# EAGLE design control_board (EAGLE 6.4)
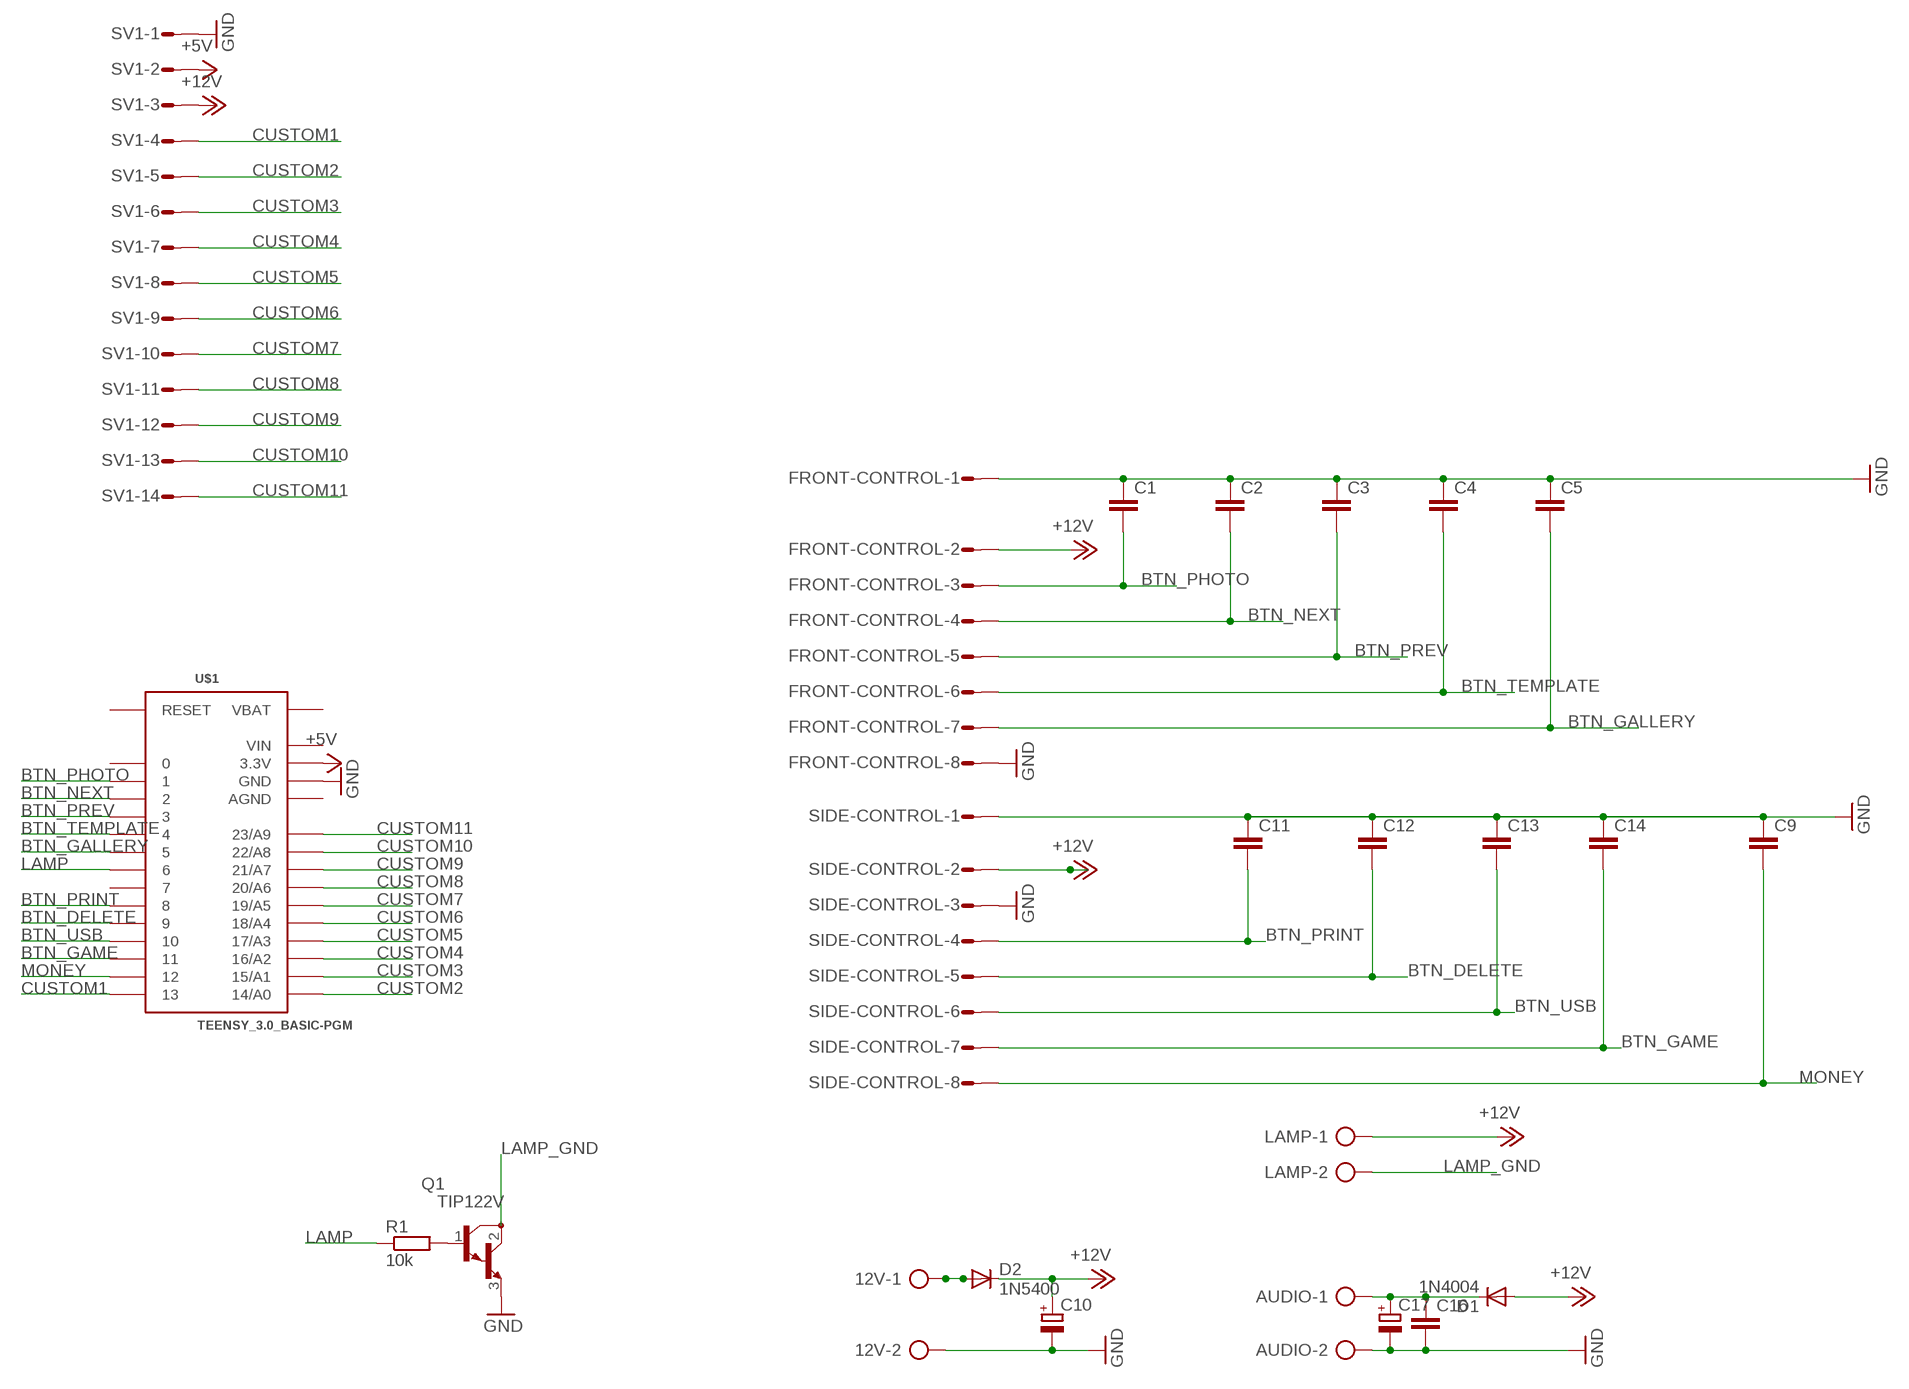
[diagram p0: schematic, sheet 1]

## Parts
12V  AK300/2  [AK300/2]
AUDIO  AK300/2  [AK300/2]
C1  C-EU025-025X050  [C025-025X050]
C2  C-EU025-025X050  [C025-025X050]
C3  C-EU025-025X050  [C025-025X050]
C4  C-EU025-025X050  [C025-025X050]
C5  C-EU025-025X050  [C025-025X050]
C9  C-EU025-025X050  [C025-025X050]
C10  CPOL-EUE5-8.5  [E5-8,5]
C11  C-EU025-025X050  [C025-025X050]
C12  C-EU025-025X050  [C025-025X050]
C13  C-EU025-025X050  [C025-025X050]
C14  C-EU025-025X050  [C025-025X050]
C16  C-EU025-025X050  [C025-025X050]
C17  CPOL-EUE5-5  [E5-5]
D1  1N4004  [DO41-10]
D2  1N5400  [DO201-15]
FRONT-CONTROL  S08P  [S08P]
LAMP  AK300/2  [AK300/2]
Q1  TIP122V  [TO220V]
R1  10k  R-EU_0204/7  [0204/7]
SIDE-CONTROL  S08P  [S08P]
SV1  S14P  [S14P]
U$1  TEENSY_3.0_BASIC-PGM  [TEENSY_3.0_BASIC-PGM]

## Nets
+5V: SV1.2 U$1.3.3V U$1.3.3V1(3.3V)
+12V: C10.+ D1.A D2.C FRONT-CONTROL.2 LAMP.1 SIDE-CONTROL.2 SV1.3
BTN_DELETE: C12.2 SIDE-CONTROL.5 U$1.9
BTN_GALLERY: C5.2 FRONT-CONTROL.7 U$1.5
BTN_GAME: C14.2 SIDE-CONTROL.7 U$1.11
BTN_NEXT: C2.2 FRONT-CONTROL.4 U$1.2
BTN_PHOTO: C1.2 FRONT-CONTROL.3 U$1.1
BTN_PREV: C3.2 FRONT-CONTROL.5 U$1.3
BTN_PRINT: C11.2 SIDE-CONTROL.4 U$1.8
BTN_TEMPLATE: C4.2 FRONT-CONTROL.6 U$1.4
BTN_USB: C13.2 SIDE-CONTROL.6 U$1.10
CUSTOM1: SV1.4 U$1.13
CUSTOM2: SV1.5 U$1.14/A0
CUSTOM3: SV1.6 U$1.15/A1
CUSTOM4: SV1.7 U$1.16/A2
CUSTOM5: SV1.8 U$1.17/A3
CUSTOM6: SV1.9 U$1.18/A4
CUSTOM7: SV1.10 U$1.19/A5
CUSTOM8: SV1.11 U$1.20/A6
CUSTOM9: SV1.12 U$1.21/A7
CUSTOM10: SV1.13 U$1.22/A8
CUSTOM11: SV1.14 U$1.23/A9
GND: 12V.2 AUDIO.2 C1.1 C2.1 C3.1 C4.1 C5.1 C9.1 C10.- C11.1 C12.1 C13.1 C14.1 C16.2 C17.- FRONT-CONTROL.1 FRONT-CONTROL.8 Q1.3(E) SIDE-CONTROL.1 SIDE-CONTROL.3 SV1.1 U$1.GND U$1.GND1(GND)
LAMP: R1.1 U$1.6
LAMP_GND: LAMP.2 Q1.2(C)
MONEY: C9.2 SIDE-CONTROL.8 U$1.12
N$1: Q1.1(B) R1.2
N$2: AUDIO.1 C16.1 C17.+ D1.C
N$3: 12V.1 D2.A
Unconnected: U$1.0 U$1.7 U$1.RESET

## Power pins joined to a net without a drawn wire
AGND: U$1.AGND
VBAT: U$1.VBAT
VIN: U$1.VIN

## Library data of the parts
12V AUDIO LAMP = con-ptr500:AK300/2: CONNECTOR; OC_FARNELL: unknown; OC_NEWARK: unknown
C1-C5 = resistor:C-EU: CAPACITOR, European symbol
C9 C11-C14 C16 = rcl:C-EU: CAPACITOR, European symbol
C10 C17 = resistor:CPOL-EU: POLARIZED CAPACITOR, European symbol
D1 = diode:1N4004: DIODE general purpose rectifier, 1 A
D2 = diode:1N5400: DIODE standard rectifier, 3 A, 50 V (Motorola)
FRONT-CONTROL SIDE-CONTROL = con-amp-mt:S08P: AMP MT CONNECTOR; OC_FARNELL: unknown; OC_NEWARK: unknown
Q1 = transistor-npn:TIP122V
R1 = resistor:R-EU_: RESISTOR, European symbol
SV1 = con-amp-mt:S14P: AMP MT CONNECTOR; OC_FARNELL: unknown; OC_NEWARK: unknown
U$1 = Teensy3.0:TEENSY_3.0_BASIC-PGM: Teensy 3.0 Board outline identical to other 'basic' version except that 'PGM' pin has been omitted. See '+4', 'AllAnalogPins", and 'AllPins' packages for additional pin holes, as needed.

## Board
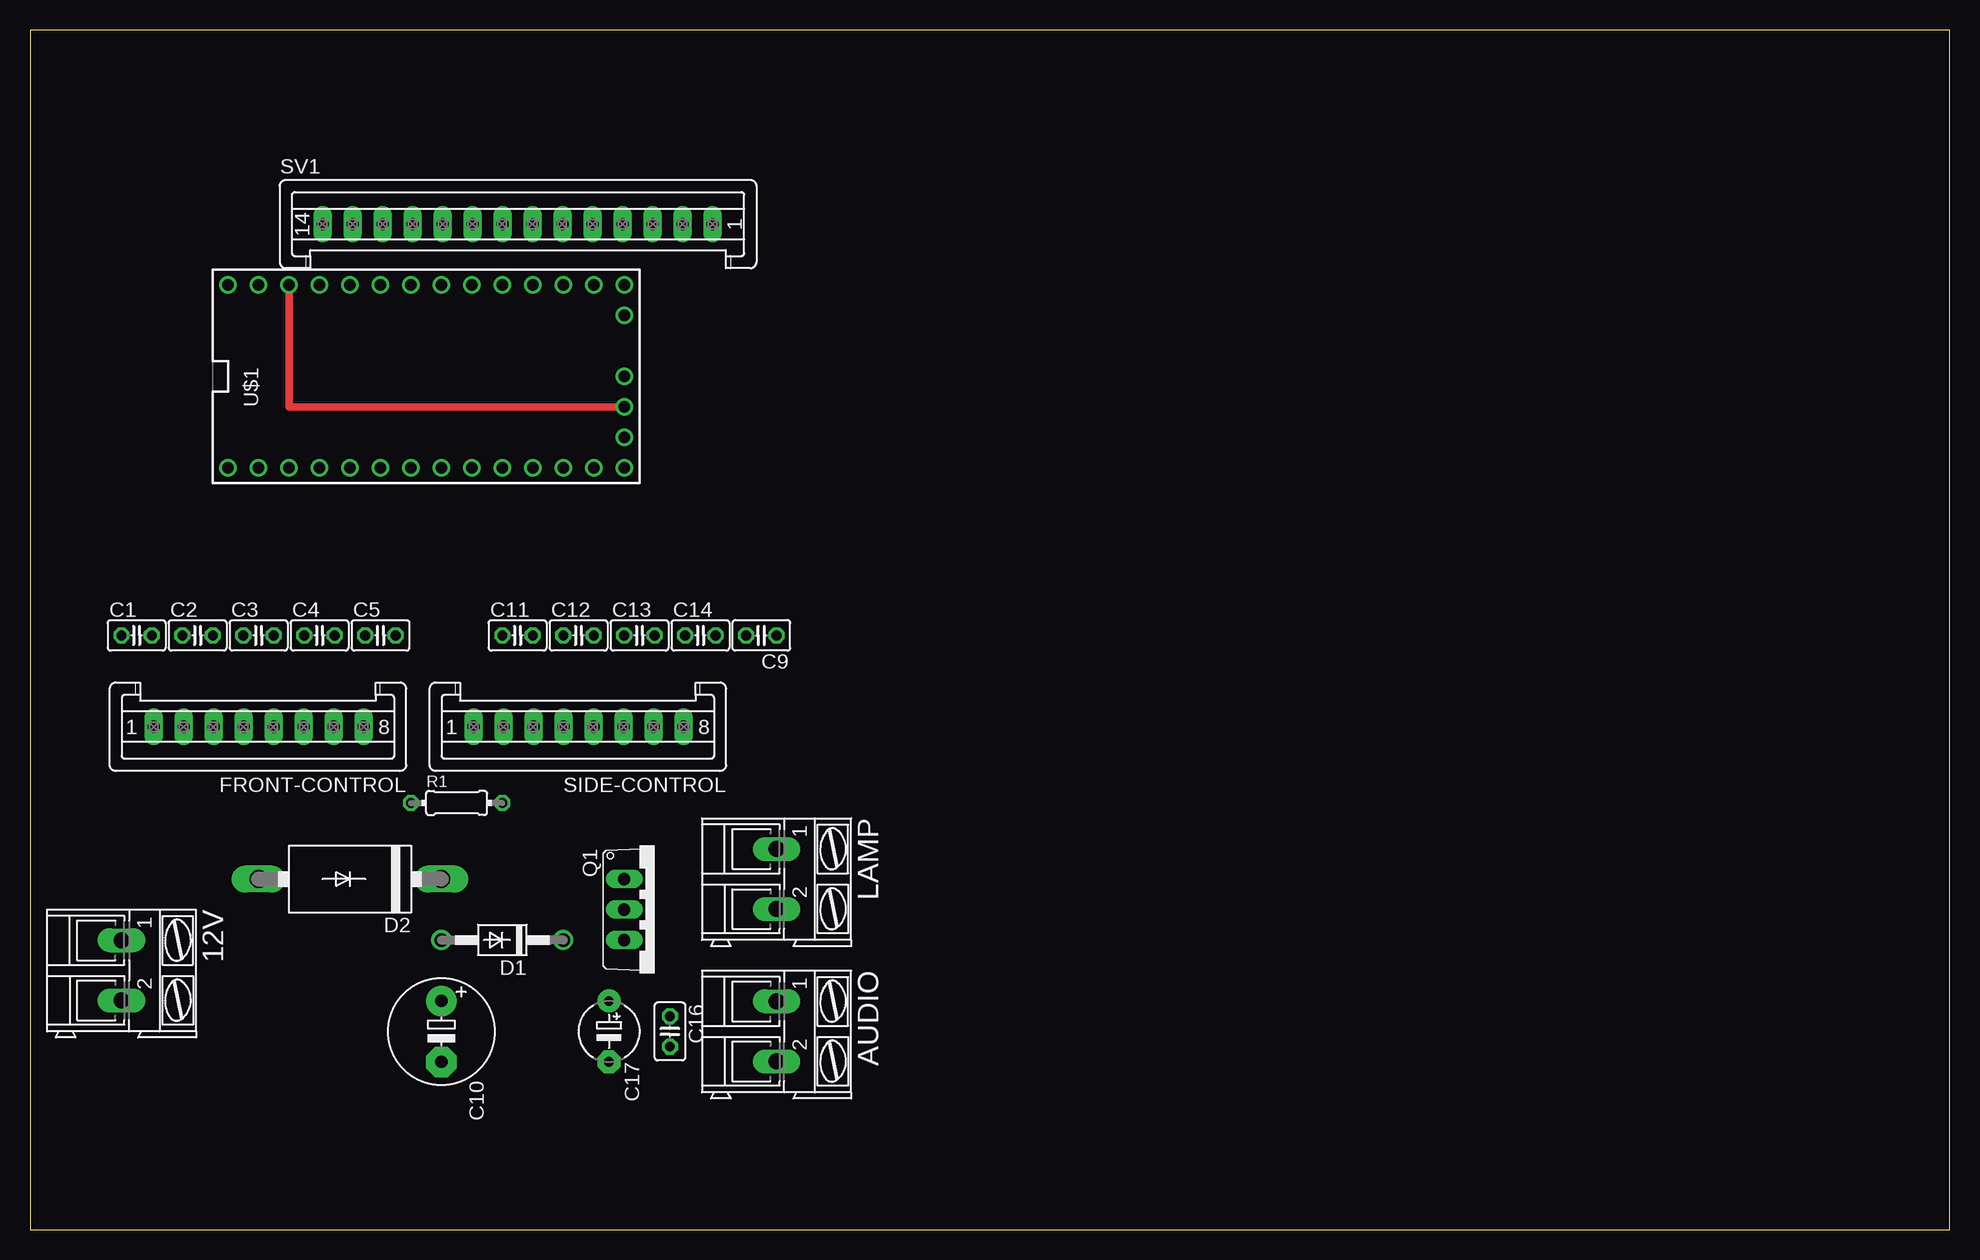
[diagram p1: board, top side]
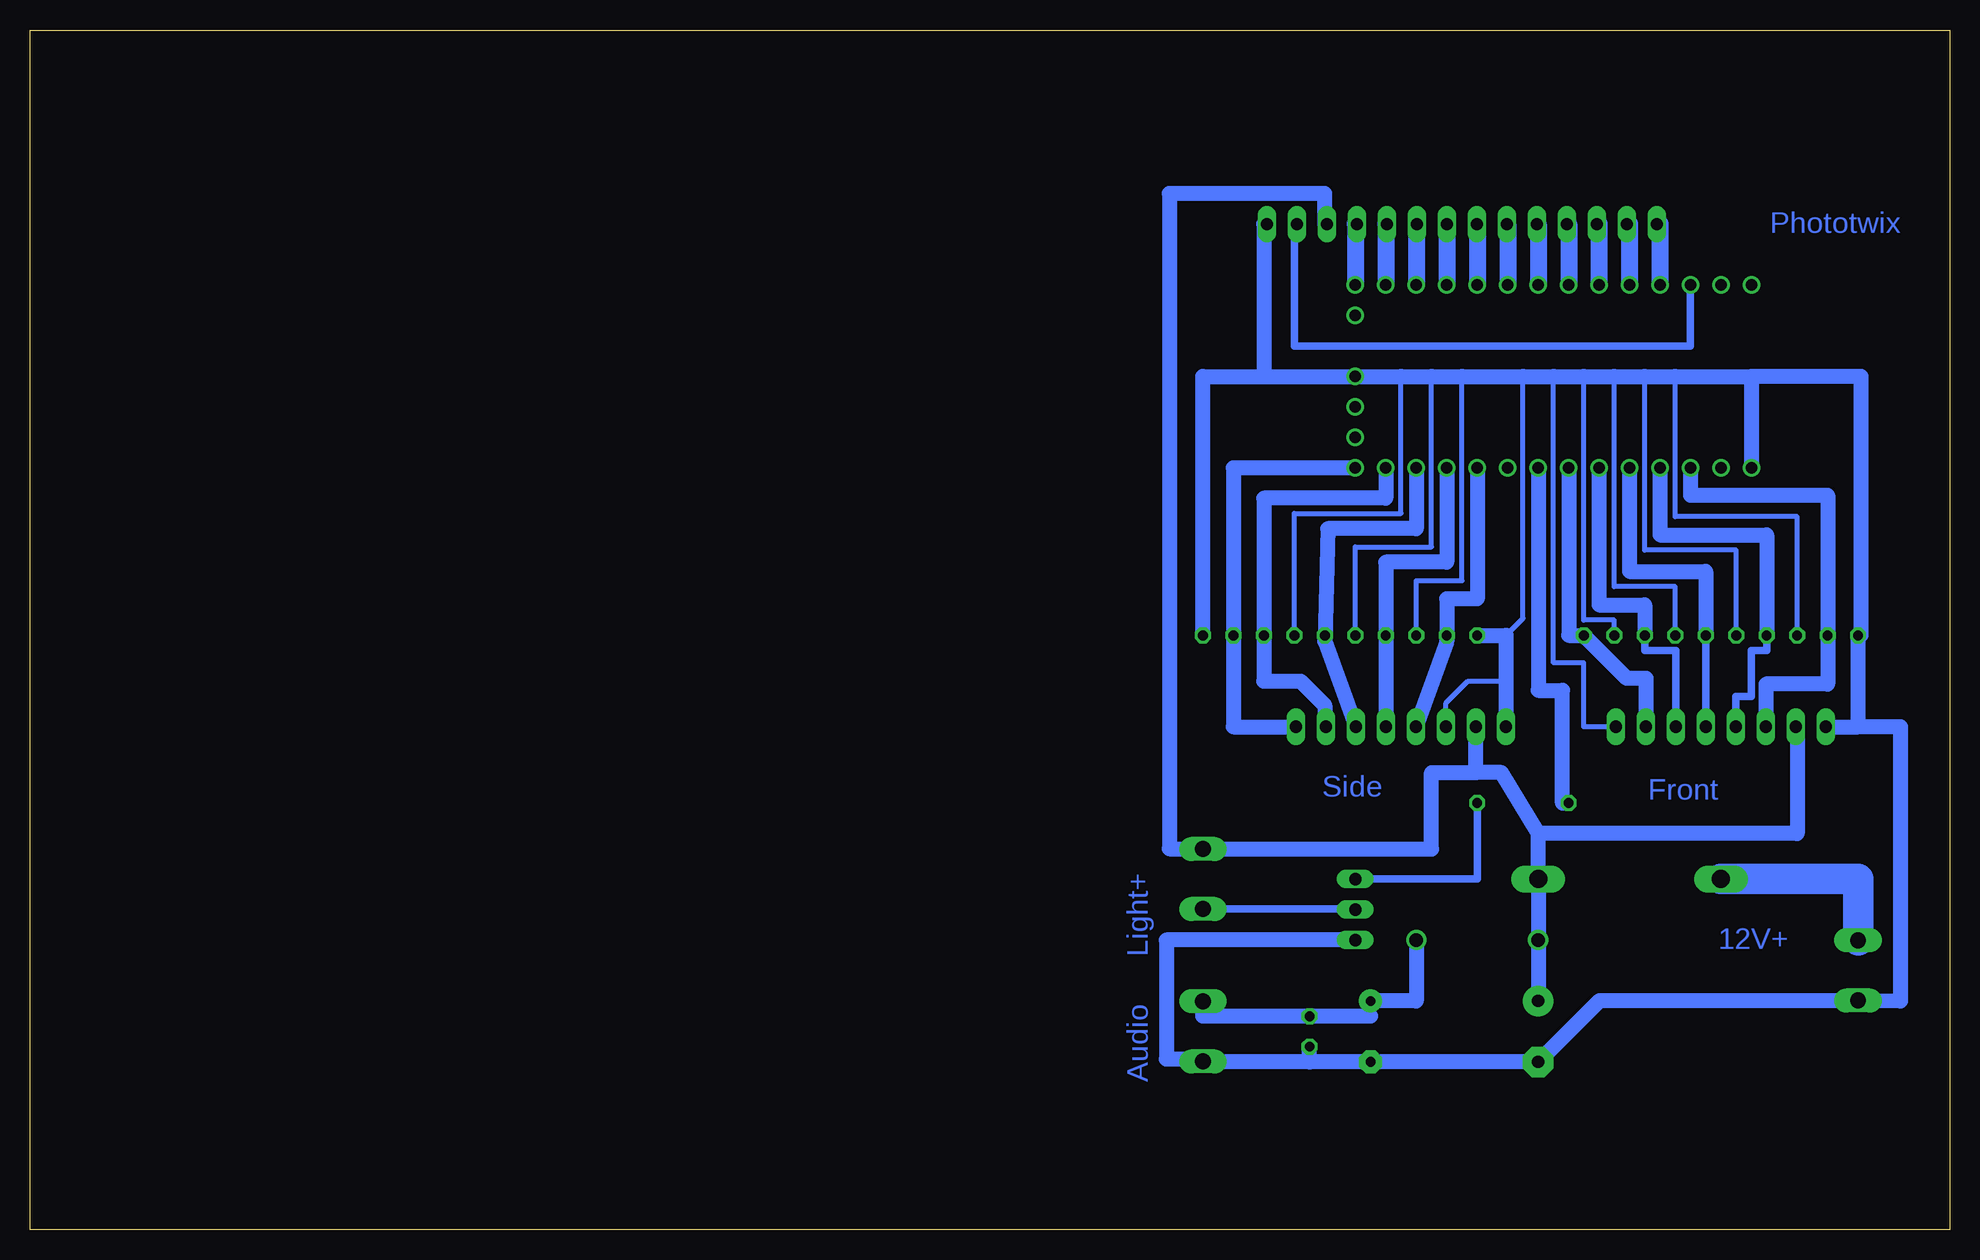
[diagram p2: board, bottom side, seen from below]

Size 160 x 100 mm. Coordinates in mm from the lower left corner, seen from the top.
Outline: 0,0 160,0 160,100 0,100 0,0
Copper layers (1*16): Top 0.035mm / dielectric 1.5mm / Bottom 0.035mm
Design rules "default": minimum track width 10mil, minimum drill 24mil, track to track 8mil, track to pad 8mil, pad to pad 8mil, via to via 8mil, smd to smd 8mil, copper to edge 40mil, drill to drill 8mil, minimum pad ring 10mil, minimum via ring 8mil, stop-mask expansion 4mil, vias tented up to drill 0mil, thermal gap 10mil

### Footprints (pad centres in the part's own frame; a part is rotated, then mirrored left to right if it is on the bottom)
AK300/2 = drill 1.321 long: 1 -2.515,0; 2 2.489,0
C025-025X050 = drill 0.813 octagon: 1 -1.27,0; 2 1.27,0
E5-8,5 = drill 1.016 pad 2.54: + -2.54,0 | drill 1.016 pad 2.54 octagon: - 2.54,0
E5-5 = drill 0.813 pad 1.905: + -2.54,0 | drill 0.813 pad 1.905 octagon: - 2.54,0
DO41-10 = drill 1.118: A 5.08,0; C -5.08,0
DO201-15 = drill 1.499 long: A 7.62,0; C -7.62,0
S08P = drill 1.016 long: 1 8.75,0; 2 6.25,0; 3 3.75,0; 4 1.25,0; 5 -1.25,0; 6 -3.75,0; 7 -6.25,0; 8 -8.75,0
TO220V = drill 1.016 long: 1 -2.54,-2.54; 2 0,-2.54; 3 2.54,-2.54
0204/7 = drill 0.813 octagon: 1 -3.81,0; 2 3.81,0
S14P = drill 1.016 long: 1 16.25,0; 2 13.75,0; 3 11.25,0; 4 8.75,0; 5 6.25,0; 6 3.75,0; 7 1.25,0; 8 -1.25,0; 9 -3.75,0; 10 -6.25,0; 11 -8.75,0; 12 -11.25,0; 13 -13.75,0; 14 -16.25,0
TEENSY_3.0_BASIC-PGM = drill 0.965: 0 -7.62,13.97; 1 -7.62,11.43; 2 -7.62,8.89; 3 -7.62,6.35; 3.3V 7.62,11.43; 3.3V1 -2.54,-16.51; 4 -7.62,3.81; 5 -7.62,1.27; 6 -7.62,-1.27; 7 -7.62,-3.81; 8 -7.62,-6.35; 9 -7.62,-8.89; 10 -7.62,-11.43; 11 -7.62,-13.97; 12 -7.62,-16.51; 13 7.62,-16.51; 14/A0 7.62,-13.97; 15/A1 7.62,-11.43; 16/A2 7.62,-8.89; 17/A3 7.62,-6.35; 18/A4 7.62,-3.81; 19/A5 7.62,-1.27; 20/A6 7.62,1.27; 21/A7 7.62,3.81; 22/A8 7.62,6.35; 23/A9 7.62,8.89; AGND 7.62,13.97; GND -7.62,16.51; GND1 0,-16.51; RESET 5.08,-16.51; VBAT -5.08,-16.51; VIN 7.62,16.51

### Placement (x,y rotation side)
12V  7.62,21.59 270 top
AUDIO  62.23,16.51 270 top
C1  8.89,49.53 0 top
C2  13.97,49.53 0 top
C3  19.05,49.53 0 top
C4  24.13,49.53 0 top
C5  29.21,49.53 0 top
C9  60.96,49.53 180 top
C10  34.29,16.51 270 top
C11  40.64,49.53 0 top
C12  45.72,49.53 0 top
C13  50.8,49.53 0 top
C14  55.88,49.53 0 top
C16  53.34,16.51 270 top
C17  48.26,16.51 270 top
D1  39.37,24.13 180 top
D2  26.67,29.21 180 top
FRONT-CONTROL  19.05,41.91 180 top
LAMP  62.23,29.21 270 top
Q1  52.07,26.67 270 top
R1  35.56,35.56 0 top
SIDE-CONTROL  45.72,41.91 180 top
SV1  40.64,83.82 0 top
U$1  33.02,71.12 90 top

### Tracks (layer width: path | path; a pad name or v marks a point on that pad's centre or on a via)
+5V
  Top 0.61: U$1.3.3V 21.59,68.58 U$1.3.3V1
  Bottom 0.61: SV1.2 54.61,83.82 54.61,73.66 21.59,73.66 U$1.3.3V
+12V
  Bottom 0.61: FRONT-CONTROL.2 12.7,41.91 | SV1.3 52.07,83.82 | 62.23,31.75 LAMP.1
  Bottom 1.27: C10.+ D1.A D2.C 34.29,33.02 | LAMP.1 43.18,31.73 43.18,38.1 39.47,38.1 | 39.47,38.1 SIDE-CONTROL.2 | 34.29,33.02 37.34,38.1 39.47,38.1 | 12.7,41.91 12.7,33.02 34.29,33.02 | 52.07,83.82 52.07,86.36 65.02,86.36 65.02,31.75 62.23,31.75
BTN_DELETE
  Bottom 0.61: SIDE-CONTROL.5 46.99,41.91
  Bottom 1.27: U$1.9 41.91,55.63 46.99,55.63 C12.2 SIDE-CONTROL.5
BTN_GALLERY
  Bottom 0.61: 25.3,46.23 25.3,45.97
  Bottom 1.27: FRONT-CONTROL.7 25.3,45.97 26.92,45.97 C5.2 31.75,49.53 U$1.5
BTN_GAME
  Bottom 1.27: SIDE-CONTROL.7 52.07,42.01 52.07,43.69 54.1,45.72 57.15,45.72 C14.2 57.15,60.96 46.99,60.96 U$1.11
BTN_NEXT
  Bottom 0.61: C2.2 15.24,48.26 16.51,48.26 16.51,44.45 17.8,44.45 FRONT-CONTROL.4
  Bottom 1.27: U$1.2 24.13,57.91 15.24,57.91 C2.2
BTN_PHOTO
  Bottom 1.27: U$1.1 21.59,61.21 10.16,61.21 C1.2 10.16,45.47 15.3,45.47 FRONT-CONTROL.3
BTN_PREV
  Bottom 0.61: C3.2 20.3,49.53 FRONT-CONTROL.5
  Bottom 1.27: U$1.3 26.67,54.86 20.32,54.86 C3.2
BTN_PRINT
  Bottom 0.61: SIDE-CONTROL.4 44.45,41.91 | 41.91,49.02 C11.2
  Bottom 1.27: U$1.8 39.37,52.58 41.91,52.58 41.91,49.02 SIDE-CONTROL.4
BTN_TEMPLATE
  Bottom 0.61: C4.2 25.4,48.26 22.8,48.26 FRONT-CONTROL.6
  Bottom 1.27: U$1.4 29.21,52.07 25.4,52.07 C4.2
BTN_USB
  Bottom 0.61: SIDE-CONTROL.6 49.53,41.91 | 52.07,49.02 C13.2
  Bottom 1.27: U$1.10 44.45,58.42 51.82,58.42 52.07,49.02 SIDE-CONTROL.6
CUSTOM1
  Bottom 0.61: SV1.4 49.53,83.82
  Bottom 1.422: 49.53,83.82 U$1.13
CUSTOM2
  Bottom 0.61: SV1.5 46.99,83.82
  Bottom 1.422: 46.99,83.82 U$1.14/A0
CUSTOM3
  Bottom 0.61: SV1.6 44.45,83.82
  Bottom 1.422: 44.45,83.82 U$1.15/A1
CUSTOM4
  Bottom 0.61: SV1.7 41.91,83.82
  Bottom 1.422: 41.91,83.82 U$1.16/A2
CUSTOM5
  Bottom 0.61: SV1.8 39.37,83.82
  Bottom 1.422: 39.37,83.82 U$1.17/A3
CUSTOM6
  Bottom 0.61: SV1.9 36.83,83.82
  Bottom 1.422: 36.83,83.82 U$1.18/A4
CUSTOM7
  Bottom 0.61: SV1.10 34.29,83.82
  Bottom 1.422: 34.29,83.82 U$1.19/A5
CUSTOM8
  Bottom 0.61: SV1.11 31.75,83.82
  Bottom 1.422: 31.75,83.82 U$1.20/A6
CUSTOM9
  Bottom 0.61: SV1.12 29.21,83.82
  Bottom 1.422: 29.21,83.82 U$1.21/A7
CUSTOM10
  Bottom 0.61: SV1.13 26.67,83.82
  Bottom 1.422: 26.67,83.82 U$1.22/A8
CUSTOM11
  Bottom 0.61: SV1.14 24.13,83.82
  Bottom 1.422: 24.13,83.82 U$1.23/A9
GND
  Bottom 0.406: C2.1 12.7,59.44 22.86,59.44 22.86,71.12 | C3.1 17.78,56.64 25.4,56.64 25.4,71.12 | C4.1 22.86,53.59 27.94,53.59 27.94,71.12 | C5.1 27.94,50.8 30.48,50.8 30.48,71.12 | FRONT-CONTROL.8 30.48,41.91 30.48,47.24 33.02,47.24 33.02,71.12 | 36.97,49.53 35.56,50.94 35.56,71.12 | SIDE-CONTROL.3 41.97,43.88 40.13,45.72 37.22,45.72 36.97,45.97 | C12.1 44.45,54.1 40.64,54.1 40.64,71.12 | C13.1 49.53,56.9 43.18,56.9 43.18,71.12 | C14.1 54.61,59.69 45.72,59.69 45.72,71.12
  Bottom 1.27: SV1.1 57.15,83.82 57.15,71.12 | 57.15,71.12 U$1.GND1 45.72,71.12 43.18,71.12 40.64,71.12 35.56,71.12 33.02,71.12 30.48,71.12 27.94,71.12 25.4,71.12 22.86,71.12 16.51,71.12 | 16.51,71.12 U$1.GND | 16.51,71.12 7.37,71.12 7.37,49.53 C1.1 7.62,41.91 | C9.1 62.23,71.12 57.15,71.12 | 53.34,14.02 C16.2 | 53.34,14.02 AUDIO.2 62.23,14.22 65.28,14.22 65.28,24.13 Q1.3 | 53.34,14.02 53.34,13.97 C17.- C10.- 29.16,19.1 12V.2 4.06,19.05 4.06,41.91 7.62,41.91 | C11.1 36.97,49.53 36.97,45.97 SIDE-CONTROL.1 | FRONT-CONTROL.1 7.62,41.91
LAMP
  Bottom 1.27: R1.1 32.26,35.56 32.26,44.96 34.29,44.96 U$1.6
LAMP_GND
  Bottom 0.61: LAMP.2 49.53,26.72 Q1.2
MONEY
  Bottom 1.27: U$1.12 59.69,63.5 C9.2 59.69,41.91 SIDE-CONTROL.8
N$1
  Bottom 0.61: R1.2 39.37,29.21 Q1.1
N$2
  Bottom 0.61: C17.+ 48.26,17.78
  Bottom 1.27: D1.C 44.45,19.05 C17.+ | 48.26,17.78 C16.1 62.23,17.78 AUDIO.1
N$3
  Bottom 2.54: D2.A 7.62,29.21 12V.1

### Text on the board
Bottom: Phototwix | Front | Side | Light+ | 12V+ | Audio